# EAGLE design Quad Mosfet Module (EAGLE 6.3)
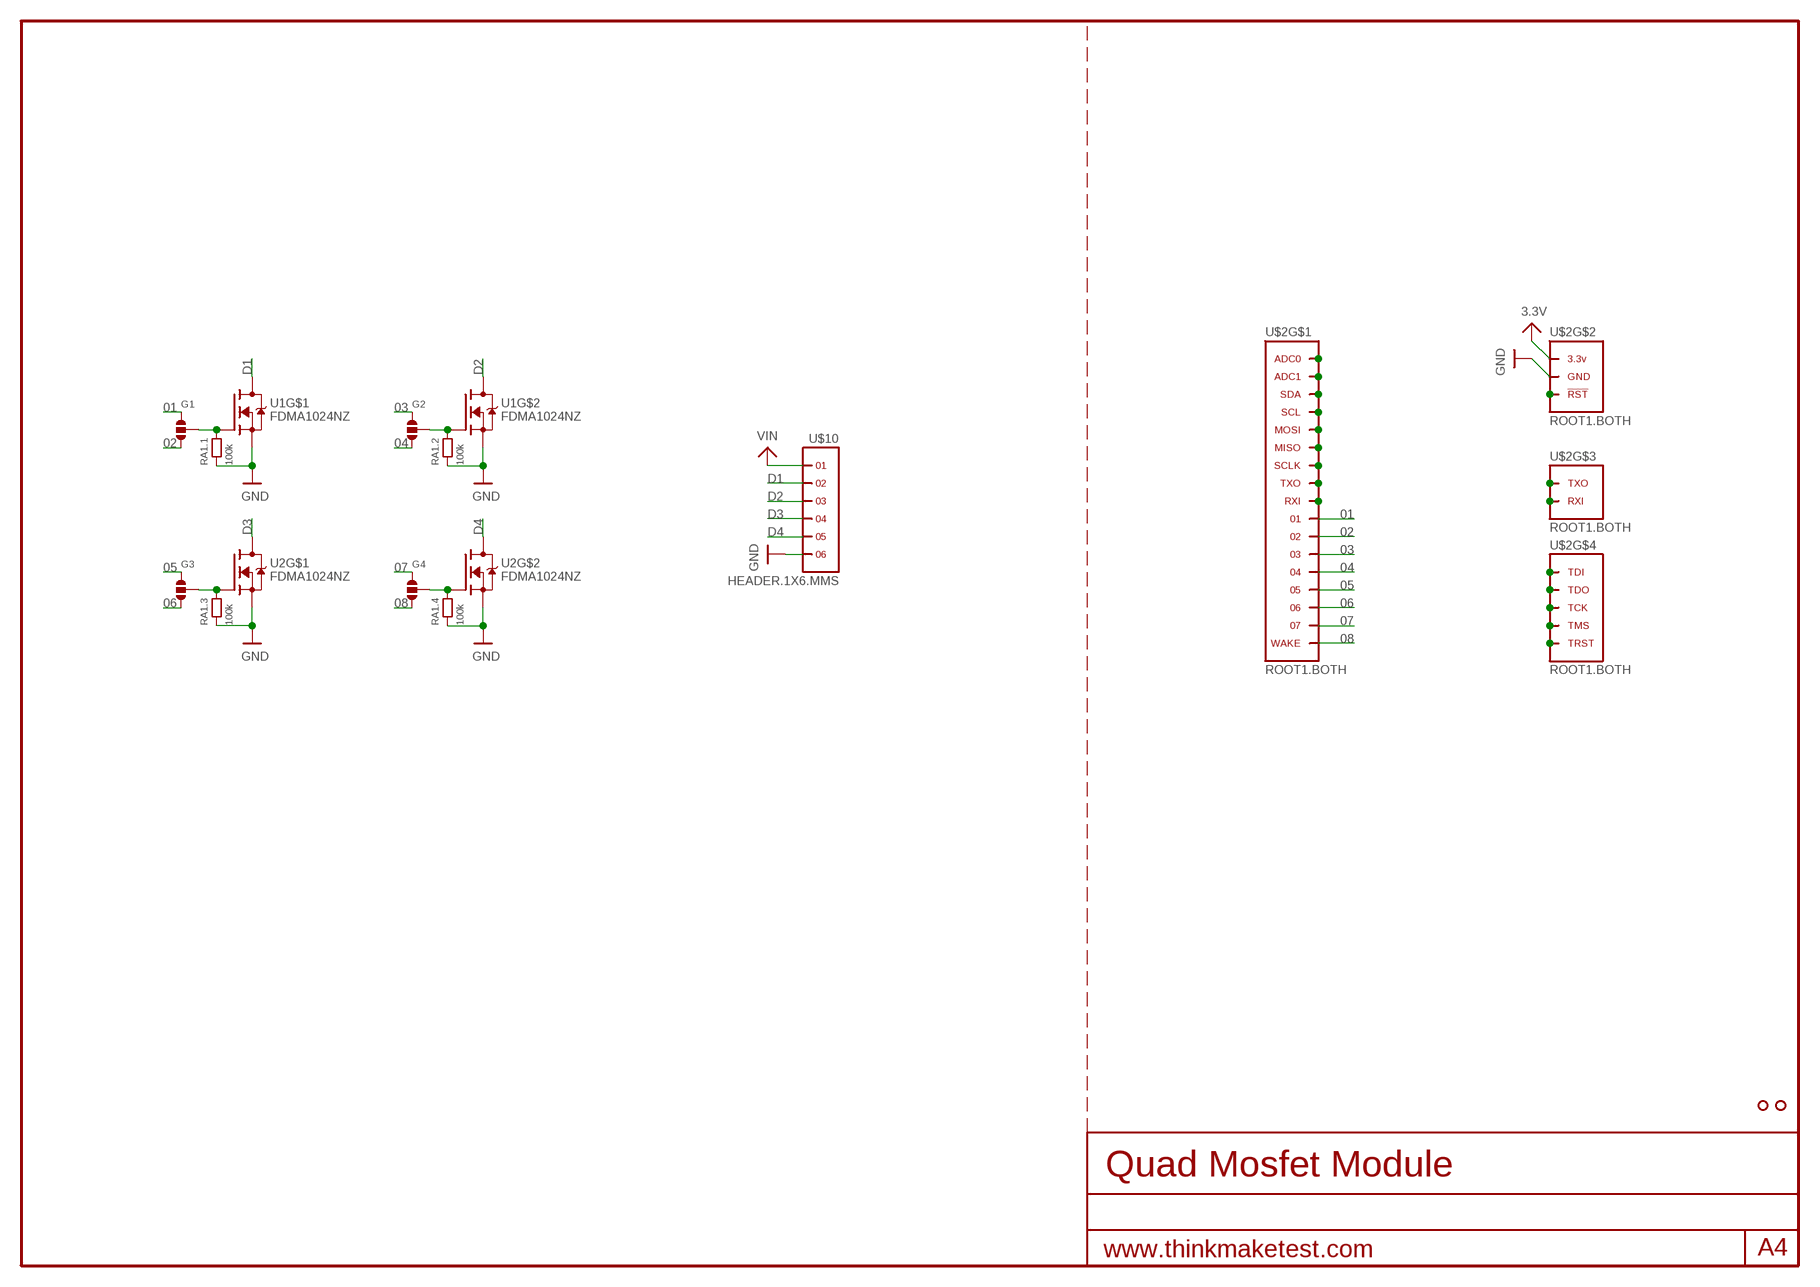
[diagram p0: schematic, sheet 1]

## Parts
G1  SOLDERJUMPER.3.MED.12  [3.MED.12]
G2  SOLDERJUMPER.3.MED.12  [3.MED.12]
G3  SOLDERJUMPER.3.MED.12  [3.MED.12]
G4  SOLDERJUMPER.3.MED.12  [3.MED.12]
RA1  100k  RA-4.0603  [0603.4.C]
U1  FDMA1024NZ  [MICROFET-6]
U2  FDMA1024NZ  [MICROFET-6]
U$2  ROOT1.BOTH  [ROOT1.BOTH]
U$3  HOLE.#2  [#2]
U$4  HOLE.#2  [#2]
U$10  HEADER.1X6.MMS  [MMS-106-02-X-SH]

## Nets
01: G1.1 U$2.01 U$2.01@1 U$2.01@VIA
02: G1.3 U$2.02 U$2.02@1 U$2.02@VIA
03: G2.1 U$2.03 U$2.03@1 U$2.03@VIA
3.3V: U$2.3.3V@1(3.3V) U$2.3.3V@2(3.3V) U$2.3.3V@3(3.3V) U$2.3.3V@4(3.3V) U$2.3.3V@5(3.3V) U$2.3.3V@6(3.3V) U$2.3.3V@7(3.3V) U$2.3.3V@8(3.3V) U$2.3.3V@9(3.3V) U$2.3.3V@10(3.3V) U$2.3.3V@11(3.3V) U$2.3.3V@12(3.3V) U$2.3.3V@13(3.3V) U$2.3.3V@14(3.3V) U$2.3.3V@15(3.3V) U$2.3.3V@16(3.3V) U$2.3.3V@17(3.3V) U$2.3.3V@18(3.3V) U$2.3.3V@19(3.3V) U$2.3.3V@20(3.3V) U$2.3.3V@21(3.3V) U$2.3.3V@22(3.3V) U$2.3.3V@23(3.3V) U$2.3.3V@24(3.3V) U$2.3.3V@VIA(3.3V)
04: G2.3 U$2.04 U$2.04@1 U$2.04@VIA
05: G3.1 U$2.05 U$2.05@1 U$2.05@VIA
06: G3.3 U$2.06 U$2.06@1 U$2.06@VIA
07: G4.1 U$2.07 U$2.07@1 U$2.07@VIA
08: G4.3 U$2.WAKE U$2.WAKE@1(WAKE) U$2.WAKE@VIA(WAKE)
D1: U1.D1(D) U1.D1@PAD(D) U$10.2 U$10.2@1
D2: U1.D2(D) U1.D2@PAD(D) U$10.3 U$10.3@1
D3: U2.D1(D) U2.D1@PAD(D) U$10.4 U$10.4@1
D4: U2.D2(D) U2.D2@PAD(D) U$10.5 U$10.5@1
GND: RA1.1 RA1.3 RA1.5 RA1.7 U1.S1(S) U1.S2(S) U2.S1(S) U2.S2(S) U$2.GND@1(GND) U$2.GND@2(GND) U$2.GND@3(GND) U$2.GND@4(GND) U$2.GND@5(GND) U$2.GND@6(GND) U$2.GND@7(GND) U$2.GND@8(GND) U$2.GND@9(GND) U$2.GND@10(GND) U$2.GND@11(GND) U$2.GND@12(GND) U$2.GND@13(GND) U$2.GND@14(GND) U$2.GND@15(GND) U$2.GND@16(GND) U$2.GND@17(GND) U$2.GND@18(GND) U$2.GND@19(GND) U$2.GND@20(GND) U$2.GND@21(GND) U$2.GND@22(GND) U$2.GND@23(GND) U$2.GND@24(GND) U$2.GND@25(GND) U$2.GND@26(GND) U$2.GND@VIA(GND) U$10.6 U$10.6@1
N$2: U$2.ADC1 U$2.ADC1@1(ADC1) U$2.ADC1@VIA(ADC1)
N$3: U$2.SDA U$2.SDA@1(SDA) U$2.SDA@VIA(SDA)
N$4: U$2.SCL U$2.SCL@1(SCL) U$2.SCL@VIA(SCL)
N$6: U$2.MISO U$2.MISO@1(MISO) U$2.MISO@VIA(MISO)
N$7: U$2.SCLK U$2.SCLK@1(SCLK) U$2.SCLK@VIA(SCLK)
N$8: U$2.TXO U$2.TXO@1(TXO) U$2.TXO@VIA(TXO)
N$9: U$2.RXI U$2.RXI@1(RXI) U$2.RXI@VIA(RXI)
N$12: U$2.MOSI U$2.MOSI@1(MOSI) U$2.MOSI@VIA(MOSI)
N$13: U$2.ADC0 U$2.ADC0@1(ADC0) U$2.ADC0@VIA(ADC0)
N$18: U$2.TDI U$2.TDI@1(TDI) U$2.TDI@VIA(TDI)
N$19: U$2.TDO U$2.TDO@1(TDO) U$2.TDO@VIA(TDO)
N$20: U$2.RST(!RST) U$2.RST@1(!RST) U$2.RST@VIA(!RST)
N$21: U$2.TMS U$2.TMS@1(TMS) U$2.TMS@VIA(TMS)
N$22: U$2.TRST U$2.TRST@1(TRST) U$2.TRST@VIA(TRST)
N$23: U$2.RXI.DBG(RXI) U$2.RXI.DBG@1(RXI) U$2.RXI.DBG@VIA(RXI)
N$24: U$2.TXO.DBG(TXO) U$2.TXO.DBG@1(TXO) U$2.TXO.DBG@VIA(TXO)
N$25: U$2.TCK U$2.TCK@1(TCK) U$2.TCK@VIA(TCK)
N$26: G1.2 RA1.2 U1.G1(G)
N$27: G2.2 RA1.4 U1.G2(G)
N$28: G3.2 RA1.6 U2.G1(G)
N$29: G4.2 RA1.8 U2.G2(G)
VIN: U$10.1 U$10.1@1

## Library data of the parts
G1-G4 = .solderjumper:SOLDERJUMPER.3
RA1 = .resistorarray:RA-4: Dimentions sources from here: http://www.ctscorp.com/components/Datasheets/CTSChipArrayDs.pdf
U1 U2 = fairchild:FDMA1024NZ
U$2 = thinkmaketest:ROOT1
U$3 U$4 = .screw_holes:HOLE
U$10 = samtec:HEADER.1X6

## Board
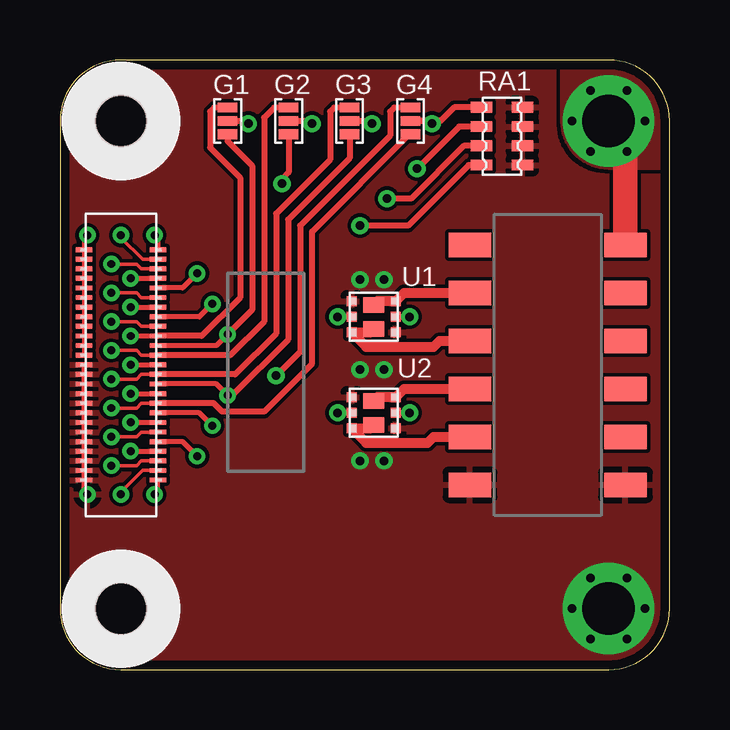
[diagram p1: board, top side]
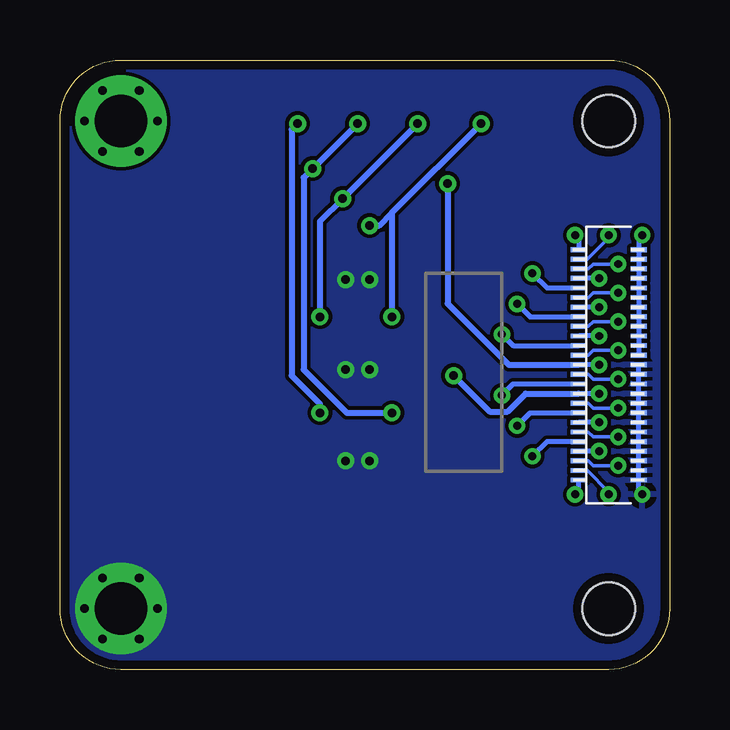
[diagram p2: board, bottom side, seen from below]

Size 25.4 x 25.4 mm. Coordinates in mm from the lower left corner, seen from the top.
Outline: 0,22.86 0,2.54 arc90 2.54,0 22.86,0 arc90 25.4,2.54 25.4,22.86 arc90 22.86,25.4 2.54,25.4 arc90 0,22.86
Copper layers (1*16): Top 0.0356mm / dielectric 1.5011mm / Bottom 0.0356mm
Design rules "default": minimum track width 6mil, minimum drill 13mil, track to track 6mil, track to pad 6mil, pad to pad 6mil, via to via 6mil, smd to smd 6mil, copper to edge 15mil, drill to drill 6mil, minimum pad ring 7mil, minimum via ring 7mil, stop-mask expansion 4mil, vias tented up to drill 16mil, thermal gap 10mil

### Footprints (pad centres in the part's own frame; a part is rotated, then mirrored left to right if it is on the bottom)
3.MED.12 = smd 0.406 x 0.813: 1 -0.559,0; 2 0,0; 3 0.559,0
0603.4.C = smd 0.45 x 0.9: 1 -1.2,-0.85; 2 -1.2,0.85; 3 -0.4,-0.85; 4 -0.4,0.85; 5 0.4,-0.85; 6 0.4,0.85; 7 1.2,-0.85; 8 1.2,0.85
MICROFET-6 = smd 0.42 x 0.42: D1 -0.65,0.915; D2 0.65,-0.915; G1 0,-0.915; G2 0,0.915; S1 -0.65,-0.915; S2 0.65,0.915 | smd 0.645 x 0.86: D1@PAD -0.5,0; D2@PAD 0.5,0
ROOT1.BOTH = smd 0.66 x 0.2 bottom: 01 3.795,13.9; 02 3.795,13.5; 03 3.795,13.1; 3.3V@1 1.285,17.5; 3.3V@2 1.285,17.1; 3.3V@3 1.285,16.7; 3.3V@4 1.285,16.3; 3.3V@5 1.285,15.9; 3.3V@6 1.285,15.5; 3.3V@7 1.285,15.1; 3.3V@8 1.285,14.7; 3.3V@9 1.285,14.3; 3.3V@10 1.285,13.9; 3.3V@11 1.285,13.5; 3.3V@12 1.285,13.1; 04 3.795,12.7; 05 3.795,12.3; 06 3.795,11.9; 07 3.795,11.5; ADC0 3.795,17.5; ADC1 3.795,17.1; GND@1 1.285,7.9; GND@2 1.285,8.3; GND@3 1.285,8.7; GND@4 1.285,9.1; GND@5 1.285,9.5; GND@6 1.285,9.9; GND@7 1.285,10.3; GND@8 1.285,10.7; GND@9 1.285,11.1; GND@10 1.285,11.5; GND@11 1.285,11.9; GND@12 1.285,12.3; GND@13 1.285,12.7; MISO 3.795,15.5; MOSI 3.795,15.9; RST 3.795,7.9; RXI 3.795,14.3; RXI.DBG 3.795,10.3; SCL 3.795,16.3; SCLK 3.795,15.1; SDA 3.795,16.7; TCK 3.795,9.1; TDI 3.795,9.9; TDO 3.795,9.5; TMS 3.795,8.7; TRST 3.795,8.3; TXO 3.795,14.7; TXO.DBG 3.795,10.7; WAKE 3.795,11.1 | smd 0.7 x 0.2: 01@1 4.08,13.9; 02@1 4.08,13.5; 3.3V@13 1,17.5; 3.3V@14 1,17.1; 3.3V@15 1,16.7; 3.3V@16 1,16.3; 3.3V@17 1,15.9; 3.3V@18 1,15.5; 3.3V@19 1,15.1; 3.3V@20 1,14.7; 3.3V@21 1,14.3; 3.3V@22 1,13.9; 3.3V@23 1,13.5; 3.3V@24 1,13.1; 03@1 4.08,13.1; 04@1 4.08,12.7; 05@1 4.08,12.3; 06@1 4.08,11.9; 07@1 4.08,11.5; ADC0@1 4.08,17.5; ADC1@1 4.08,17.1; GND@14 1,7.9; GND@15 1,8.3; GND@16 1,8.7; GND@17 1,9.1; GND@18 1,9.5; GND@19 1,9.9; GND@20 1,10.3; GND@21 1,10.7; GND@22 1,11.1; GND@23 1,11.5; GND@24 1,11.9; GND@25 1,12.3; GND@26 1,12.7; MISO@1 4.08,15.5; MOSI@1 4.08,15.9; RST@1 4.08,7.9; RXI.DBG@1 4.08,10.3; RXI@1 4.08,14.3; SCL@1 4.08,16.3; SCLK@1 4.08,15.1; SDA@1 4.08,16.7; TCK@1 4.08,9.1; TDI@1 4.08,9.9; TDO@1 4.08,9.5; TMS@1 4.08,8.7; TRST@1 4.08,8.3; TXO.DBG@1 4.08,10.7; TXO@1 4.08,14.7; WAKE@1 4.08,11.1 | drill 0.33 pad 0.686: 01@VIA 2.94,13.9; 02@VIA 6.985,13.97; 3.3V@VIA 1.14,18.1; 03@VIA 2.14,13.3; 04@VIA 2.94,12.7; 05@VIA 2.14,12.1; 06@VIA 6.985,11.43; 07@VIA 2.94,11.5; ADC0@VIA 3.94,18.1; ADC1@VIA 2.54,18.1; GND@VIA 1.14,7.3; MISO@VIA 2.14,15.7; MOSI@VIA 5.715,16.51; RST@VIA 3.94,7.3; RXI.DBG@VIA 2.94,10.3; RXI@VIA 2.14,14.5; SCL@VIA 2.94,16.3; SCLK@VIA 2.94,15.1; SDA@VIA 2.14,16.9; TCK@VIA 2.94,9.1; TDI@VIA 2.14,9.7; TDO@VIA 5.715,8.89; TMS@VIA 2.14,8.5; TRST@VIA 2.54,7.3; TXO.DBG@VIA 6.35,10.16; TXO@VIA 6.35,15.24; WAKE@VIA 2.14,10.9
#2 = hole 2.184: 0,0
MMS-106-02-X-SH = smd 1.02 x 1.78: 1 -5,-3.24; 1@1 -5,3.24; 2 -3,-3.24; 2@1 -3,3.24; 3 -1,-3.24; 3@1 -1,3.24; 4 1,-3.24; 4@1 1,3.24; 5 3,-3.24; 5@1 3,3.24; 6 5,-3.24; 6@1 5,3.24

### Placement (x,y rotation side)
G1  6.99,22.86 270 top
G2  9.53,22.86 270 top
G3  12.06,22.86 270 top
G4  14.61,22.86 270 top
RA1  18.41,22.23 90 top
U1  13.07,14.7 270 top
U2  13.07,10.7 270 top
U$2  0,0 0 top
U$3  2.54,2.54 90 top
U$4  2.54,22.86 90 top
U$10  20.32,12.7 270 top

### Tracks (layer width: path | path; a pad name or v marks a point on that pad's centre or on a via)
01
  Top 0.254: U$2.01@1 5.9,13.9 7.5,15.5 7.5,20.5 6.25,21.75 6.25,23.25 6.42,23.42 G1.1
02
  Top 0.254: U$2.02@VIA 8,14.98 8,21 6.99,22.02 G1.3
03
  Top 0.254: U$2.03@1 7.1,13.1 8.5,14.5 8.5,23 8.92,23.42 G2.1
04  (via drill 0.36)
  Top 0.254: v9.25,20.25 9.25,20.44 9.53,20.71 G2.3
  Bottom 0.254: v9.25,20.25 9.25,15.25 6.7,12.7 U$2.04
05
  Top 0.254: U$2.05@1 7.3,12.3 9,14 9,19 11.25,21.25 11.25,23.25 11.42,23.42 G3.1
06
  Top 0.254: U$2.06@VIA 7.18,11.43 9.5,13.75 9.5,18.75 12.06,21.32 G3.3
07  (via drill 0.36)
  Top 0.254: v9,12.25 10,13.25 10,18.5 13.75,22.25 13.75,23.25 13.92,23.42 G4.1
  Bottom 0.254: v9,12.25 7.5,10.75 6.75,10.75 6,11.5 U$2.07
08
  Top 0.254: U$2.WAKE@1 6.4,11.1 6.75,10.75 8.5,10.75 10.5,12.75 10.5,18.25 14.55,22.3 G4.3
D1
  Top 0.406: U$10.2 14.34,15.7 U1.D1 13.22,15.35 U1.D1@PAD
D2
  Top 0.406: U$10.3 15.82,13.7 15.57,13.45 12.76,13.45 U1.D2 12.92,14.05 U1.D2@PAD
D3
  Top 0.406: U$10.4 14.34,11.7 U2.D1 13.22,11.35 U2.D1@PAD
D4
  Top 0.406: U$10.5 15.57,9.7 15.32,9.45 12.76,9.45 U2.D2 12.92,10.05 U2.D2@PAD
GND  (via drill 0.36, 2.18 pad 3.81)
  other vias: 22.86,2.54 21.34,2.54 24.38,2.54 22.1,3.81 23.62,3.81 23.62,1.27 22.1,1.27 12.5,16.25 13.5,16.25 12.5,12.5 13.5,12.5 12.5,8.7 13.5,8.7
  pour Bottom (rank 6): 0,0 25.4,0 25.4,25.4 0,25.4
  pour Top (rank 6): 0,0 25.4,0 25.4,25.4 0,25.4
N$26  (via drill 0.36)
  Top 0.254: U1.G1 v11.57,14.7 | RA1.2 17.02,21.02 14.5,18.5 v12.5,18.5 | G1.2 7.74,22.86 v7.85,22.75
  Bottom 0.254: 11.57,19.03 v11.57,14.7 | v7.85,22.75 11.57,19.03 | v12.5,18.5 12.1,18.5 11.57,19.03
N$27  (via drill 0.36)
  Top 0.254: U1.G2 v14.57,14.7 | RA1.4 16.82,21.82 14.62,19.62 v13.62,19.62 | G2.2 10.39,22.86 v10.5,22.75
  Bottom 0.254: v14.57,14.7 14.57,18.68 v13.62,19.62 v10.5,22.75
N$28  (via drill 0.36)
  Top 0.254: U2.G1 v11.57,10.7 | RA1.6 16.62,22.62 v14.88,20.88 | G3.2 12.89,22.86 v13,22.75
  Bottom 0.254: v11.57,10.7 13.45,10.7 15.25,12.5 15.25,20.5 v14.88,20.88 v13,22.75
N$29  (via drill 0.36)
  Top 0.254: U2.G2 v14.57,10.7 | RA1.8 16.43,23.43 15.86,22.86 G4.2 15.39,22.86 v15.5,22.75
  Bottom 0.254: v14.57,10.7 14.57,11.07 15.75,12.25 15.75,22.5 v15.5,22.75
VIN  (via drill 0.36, 2.18 pad 3.81)
  Top 1.016: U$10.1@1 23.56,22.16 v22.86,22.86
  other vias: 24.38,22.86 21.34,22.86 22.1,24.13 23.62,24.13 23.62,21.59 22.1,21.59
  pour Top: 20.95,25.4 20.95,22.86 arc90 22.86,20.95 25.4,20.95 25.4,22.86 arc90 22.86,25.4

### Text on the board
tDocu: 1 / 2 | 3 / 4 | 5 / 6 | 7 / 8 | Vin / D1 / D2 / D3 / D4 / GND
bDocu: Vin / D1 / D2 / D3 / D4 / GND | v1 | Cruz Monrreal II | AnomalousMaker.com